# EAGLE schematic Schaltplan Mark4 (EAGLE 9.6.2)
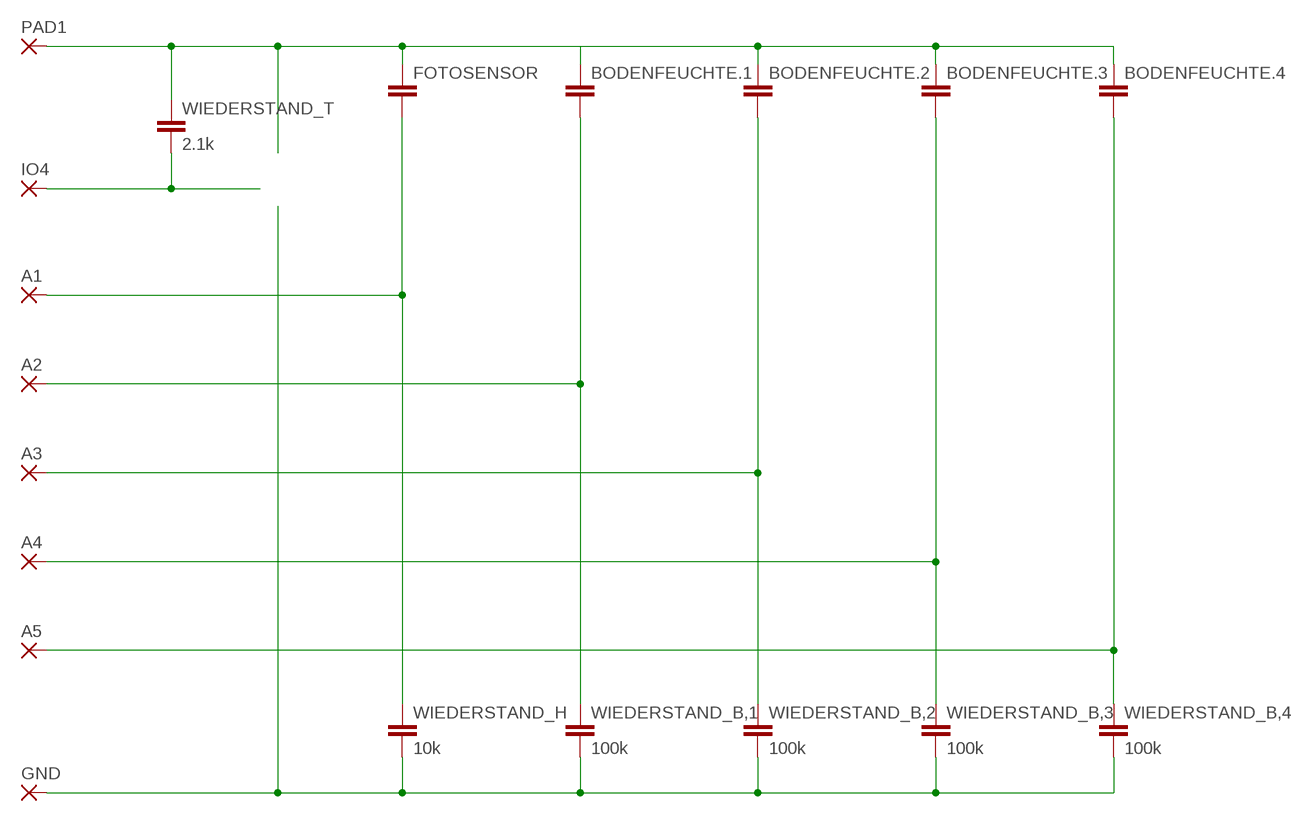
[diagram p0: schematic, sheet 1]

## Parts
A1  SMD2  [SMD1,27-2,54]
A2  SMD2  [SMD1,27-2,54]
A3  SMD2  [SMD1,27-2,54]
A4  SMD2  [SMD1,27-2,54]
A5  SMD2  [SMD1,27-2,54]
BODENFEUCHTE.1  C-EU050-024X044  [C050-024X044]
BODENFEUCHTE.2  C-EU050-024X044  [C050-024X044]
BODENFEUCHTE.3  C-EU050-024X044  [C050-024X044]
BODENFEUCHTE.4  C-EU050-024X044  [C050-024X044]
FOTOSENSOR  C-EU050-024X044  [C050-024X044]
GND  SMD2  [SMD1,27-2,54]
IO4  SMD2  [SMD1,27-2,54]
PAD1  SMD2  [SMD1,27-2,54]
WIEDERSTAND_B,1  100k  C-EU050-024X044  [C050-024X044]
WIEDERSTAND_B,2  100k  C-EU050-024X044  [C050-024X044]
WIEDERSTAND_B,3  100k  C-EU050-024X044  [C050-024X044]
WIEDERSTAND_B,4  100k  C-EU050-024X044  [C050-024X044]
WIEDERSTAND_H  10k  C-EU050-024X044  [C050-024X044]
WIEDERSTAND_T  2.1k  C-EU050-024X044  [C050-024X044]

## Nets
N$1: GND.1(P) WIEDERSTAND_B,1.2 WIEDERSTAND_B,2.2 WIEDERSTAND_B,3.2 WIEDERSTAND_B,4.2 WIEDERSTAND_H.2
N$2: BODENFEUCHTE.1.1 BODENFEUCHTE.2.1 BODENFEUCHTE.3.1 BODENFEUCHTE.4.1 FOTOSENSOR.1 PAD1.1(P) WIEDERSTAND_T.1
N$3: IO4.1(P) WIEDERSTAND_T.2
N$4: A1.1(P) FOTOSENSOR.2 WIEDERSTAND_H.1
N$5: A2.1(P) BODENFEUCHTE.1.2 WIEDERSTAND_B,1.1
N$6: A3.1(P) BODENFEUCHTE.2.2 WIEDERSTAND_B,2.1
N$7: A4.1(P) BODENFEUCHTE.3.2 WIEDERSTAND_B,3.1
N$8: A5.1(P) BODENFEUCHTE.4.2 WIEDERSTAND_B,4.1

## Library data of the parts
A1-A5 GND IO4 PAD1 = wirepad:SMD2: SMD PAD
BODENFEUCHTE.1-BODENFEUCHTE.4 FOTOSENSOR WIEDERSTAND_B,1-WIEDERSTAND_B,4 WIEDERSTAND_H WIEDERSTAND_T = rcl:C-EU: CAPACITOR, European symbol; SPICEPREFIX: C